# Altium schematic sheet PERfECT-PRO.SchDoc
size A4
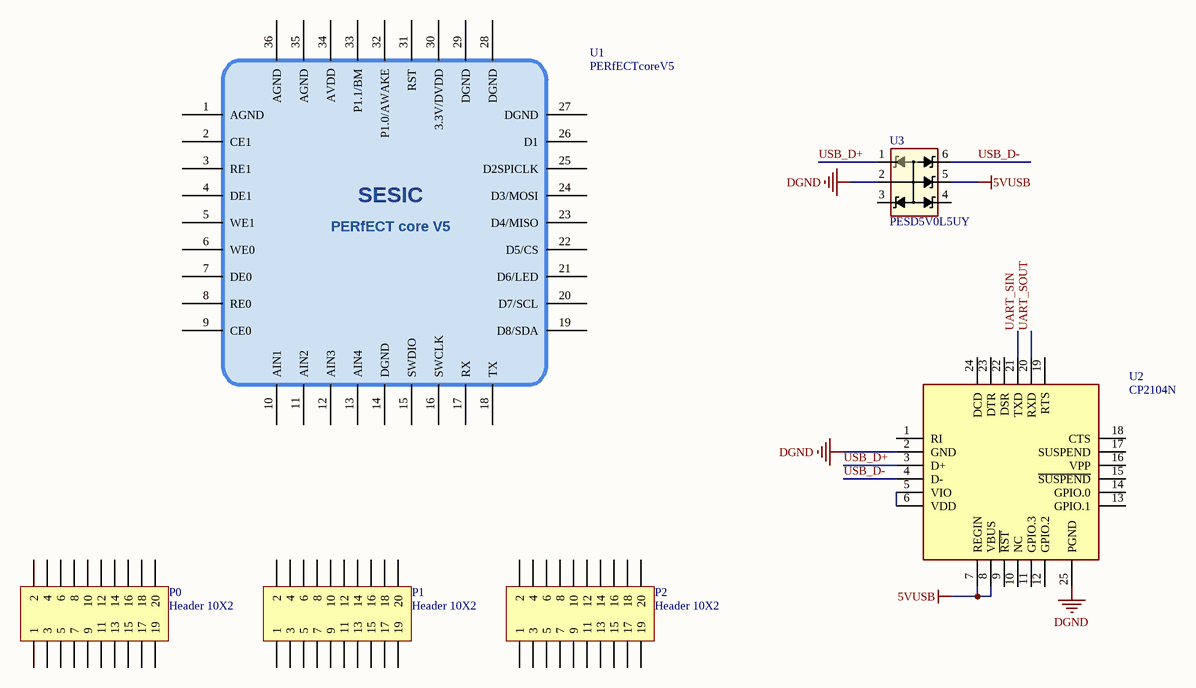
[diagram p0: PERfECT-PRO.SchDoc]

## Parts
P0  Header 10X2  [HDR2X10]
P1  Header 10X2  [HDR2X10]
P2  Header 10X2  [HDR2X10]
U1  PERfECTcoreV5  [PERfECTcore36]
U2  CP2104N  [24-QFN]
U3  PESD5V0L5UY  [SOT65P210X110-6N]

## Nets
5VUSB: U2.7(REGIN) U2.8(VBUS) U3.5
DGND: U2.2(GND) U2.25(PGND) U3.2
UART_SIN: U2.21(TXD)
UART_SOUT: U2.20(RXD)
USB_D+: U2.3(D+) U3.1
USB_D-: U2.4(D-) U3.6
NetU2_5: U2.5(VIO) U2.6(VDD)

Not connected (* = marked no-connect by the designer): P0 1 2 3 4 5 6 7 8 9 10 11 12 13 14 15 16 17 18 19 20; P1 1 2 3 4 5 6 7 8 9 10 11 12 13 14 15 16 17 18 19 20; P2 1 2 3 4 5 6 7 8 9 10 11 12 13 14 15 16 17 18 19 20; U1 1(AGND) 2(CE1) 3(RE1) 4(DE1) 5(WE1) 6(WE0) 7(DE0) 8(RE0) 9(CE0) 10(AIN1) 11(AIN2) 12(AIN3) 13(AIN4) 14(DGND) 15(SWDIO) 16(SWCLK) 17(RX) 18(TX) 19(D8/SDA) 20(D7/SCL) 21(D6/LED) 22(D5/CS) 23(D4/MISO) 24(D3/MOSI) 25(D2SPICLK) 26(D1) 27(DGND) 28(DGND) 29(DGND) 30(3.3V/DVDD) 31(RST) 32(P1.0/AWAKE) 33(P1.1/BM) 34(AVDD) 35(AGND) 36(AGND); U2 1(RI) 9(~{RST}) 10(NC) 11(GPIO.3) 12(GPIO.2) 13(GPIO.1) 14(GPIO.0) 15(~{SUSPEND}) 16(VPP) 17(SUSPEND) 18(CTS) 19(RTS) 22(DSR) 23(DTR) 24(DCD); U3 3 4

## Notes on the sheet
- (in symbol PERfECTcoreV5) SESIC; PERfECT core V5

## Library data of the parts
P0-P2 = Header 10X2: Header, 10-Pin, Dual row; LatestRevisionDate: 17-Jul-2002; LatestRevisionNote: Re-released for DXP Platform.; Publisher: Altium Limited
U1 = PERfECTcoreV5: This is the 5th version of PERfEC core.https://github.com/WISE-PERfECT/PERfECT
U2 = CP2104N: IC BRIDGE USB TO UART 24QFN; Manufacturer: Silicon Labs; PartNumber: C47742; Vendor: LCSC; Part_Footprint: 24QFN; Value: CP2104N
U3 = PESD5V0L5UY: TVS SOT-363 RoHS; Manufacturer: Yenji; Vendor: LCSC; Value: ESD; PartNumber: PESD5V0L5UY